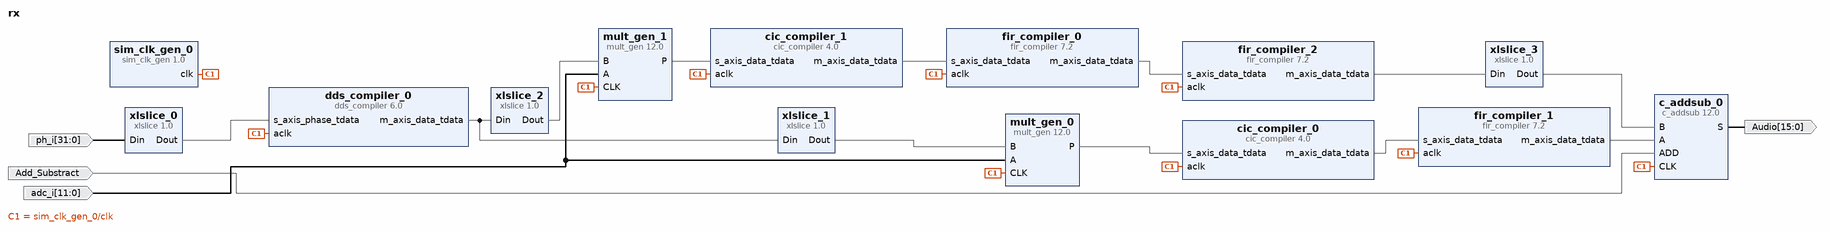
[diagram p0: block diagram of the top level]
# Vivado block design rx, xc7z020clg484-1, Vivado 2024.1
create_bd_design rx

create_bd_port -dir I -from 11 -to 0 -type data adc_i
create_bd_port -dir I -type data Add_Substract
create_bd_port -dir O -from 15 -to 0 -type data Audio
create_bd_port -dir I -from 31 -to 0 -type data ph_i

create_bd_cell -type ip -vlnv xilinx.com:ip:mult_gen:12.0 mult_gen_0
set_property -dict [list \
  CONFIG.Multiplier_Construction Use_LUTs \
  CONFIG.OutputWidthHigh 31 \
  CONFIG.PortAWidth 12 \
  CONFIG.PortBWidth 20 \
  CONFIG.SyncClear false \
  CONFIG.Use_Custom_Output_Width true \
] [get_bd_cells mult_gen_0]
create_bd_cell -type ip -vlnv xilinx.com:ip:mult_gen:12.0 mult_gen_1
set_property -dict [list \
  CONFIG.Multiplier_Construction Use_LUTs \
  CONFIG.OutputWidthHigh 31 \
  CONFIG.PortAWidth 12 \
  CONFIG.PortBWidth 20 \
  CONFIG.SyncClear false \
  CONFIG.Use_Custom_Output_Width true \
] [get_bd_cells mult_gen_1]
create_bd_cell -type ip -vlnv xilinx.com:ip:dds_compiler:6.0 dds_compiler_0
set_property -dict [list \
  CONFIG.DATA_Has_TLAST Not_Required \
  CONFIG.DDS_Clock_Rate 100 \
  CONFIG.Frequency_Resolution 0.4 \
  CONFIG.Has_Phase_Out false \
  CONFIG.Latency 7 \
  CONFIG.M_DATA_Has_TUSER Not_Required \
  CONFIG.Noise_Shaping Taylor_Series_Corrected \
  CONFIG.OUTPUT_FORM Twos_Complement \
  CONFIG.Output_Frequency1 0 \
  CONFIG.Output_Selection Sine_and_Cosine \
  CONFIG.Output_Type Integer \
  CONFIG.Output_Width 20 \
  CONFIG.PINC1 0 \
  CONFIG.Parameter_Entry Hardware_Parameters \
  CONFIG.PartsPresent SIN_COS_LUT_only \
  CONFIG.Phase_Width 25 \
  CONFIG.S_PHASE_Has_TUSER Not_Required \
] [get_bd_cells dds_compiler_0]
create_bd_cell -type ip -vlnv xilinx.com:ip:xlslice:1.0 xlslice_1
set_property -dict {CONFIG.DIN_FROM 43 CONFIG.DIN_TO 24 CONFIG.DIN_WIDTH 48 CONFIG.DOUT_WIDTH 20} [get_bd_cells xlslice_1]
create_bd_cell -type ip -vlnv xilinx.com:ip:xlslice:1.0 xlslice_2
set_property -dict {CONFIG.DIN_FROM 19 CONFIG.DIN_TO 0 CONFIG.DIN_WIDTH 48 CONFIG.DOUT_WIDTH 20} [get_bd_cells xlslice_2]
create_bd_cell -type ip -vlnv xilinx.com:ip:cic_compiler:4.0 cic_compiler_0
set_property -dict [list \
  CONFIG.Clock_Frequency 65 \
  CONFIG.Filter_Type Decimation \
  CONFIG.Fixed_Or_Initial_Rate 43 \
  CONFIG.Input_Data_Width 32 \
  CONFIG.Input_Sample_Frequency 65 \
  CONFIG.Maximum_Rate 43 \
  CONFIG.Minimum_Rate 43 \
  CONFIG.Output_Data_Width 32 \
  CONFIG.Quantization Truncation \
  CONFIG.RateSpecification Frequency_Specification \
  CONFIG.SamplePeriod 1 \
] [get_bd_cells cic_compiler_0]
create_bd_cell -type ip -vlnv xilinx.com:ip:cic_compiler:4.0 cic_compiler_1
set_property -dict [list \
  CONFIG.Clock_Frequency 65 \
  CONFIG.Filter_Type Decimation \
  CONFIG.Fixed_Or_Initial_Rate 43 \
  CONFIG.Input_Data_Width 32 \
  CONFIG.Input_Sample_Frequency 65 \
  CONFIG.Maximum_Rate 43 \
  CONFIG.Minimum_Rate 43 \
  CONFIG.Output_Data_Width 32 \
  CONFIG.Quantization Truncation \
  CONFIG.RateSpecification Frequency_Specification \
  CONFIG.SamplePeriod 1 \
] [get_bd_cells cic_compiler_1]
create_bd_cell -type ip -vlnv xilinx.com:ip:fir_compiler:7.2 fir_compiler_0
set_property -dict [list \
  CONFIG.Clock_Frequency 64.896 \
  CONFIG.CoefficientSource COE_File \
  CONFIG.CoefficientVector -202,-158,-58,246,917,2079,3771,5916,8318,10689,12701,14052,14527,14052,12701,10689,8318,5916,3771,2079,917,246,-58,-158,-202 \
  CONFIG.Coefficient_File ../../../../../../../../matlab/fir_decimator.coe \
  CONFIG.Coefficient_Fractional_Bits 0 \
  CONFIG.Coefficient_Sets 1 \
  CONFIG.Coefficient_Sign Signed \
  CONFIG.Coefficient_Structure Inferred \
  CONFIG.Coefficient_Width 16 \
  CONFIG.Data_Width 32 \
  CONFIG.Decimation_Rate 8 \
  CONFIG.Filter_Architecture Systolic_Multiply_Accumulate \
  CONFIG.Filter_Type Decimation \
  CONFIG.Interpolation_Rate 1 \
  CONFIG.Number_Channels 1 \
  CONFIG.Output_Rounding_Mode Non_Symmetric_Rounding_Up \
  CONFIG.Output_Width 16 \
  CONFIG.Quantization Integer_Coefficients \
  CONFIG.RateSpecification Frequency_Specification \
  CONFIG.Sample_Frequency 0.384 \
  CONFIG.Zero_Pack_Factor 1 \
] [get_bd_cells fir_compiler_0]
create_bd_cell -type ip -vlnv xilinx.com:ip:fir_compiler:7.2 fir_compiler_1
set_property -dict [list \
  CONFIG.Clock_Frequency 64.896 \
  CONFIG.CoefficientSource COE_File \
  CONFIG.CoefficientVector -202,-158,-58,246,917,2079,3771,5916,8318,10689,12701,14052,14527,14052,12701,10689,8318,5916,3771,2079,917,246,-58,-158,-202 \
  CONFIG.Coefficient_File ../../../../../../../../matlab/fir_decimator.coe \
  CONFIG.Coefficient_Fractional_Bits 0 \
  CONFIG.Coefficient_Sets 1 \
  CONFIG.Coefficient_Sign Signed \
  CONFIG.Coefficient_Structure Inferred \
  CONFIG.Coefficient_Width 16 \
  CONFIG.Data_Width 32 \
  CONFIG.Decimation_Rate 8 \
  CONFIG.Filter_Architecture Systolic_Multiply_Accumulate \
  CONFIG.Filter_Type Decimation \
  CONFIG.Interpolation_Rate 1 \
  CONFIG.Number_Channels 1 \
  CONFIG.Output_Rounding_Mode Non_Symmetric_Rounding_Up \
  CONFIG.Output_Width 16 \
  CONFIG.Quantization Integer_Coefficients \
  CONFIG.RateSpecification Frequency_Specification \
  CONFIG.Sample_Frequency 0.384 \
  CONFIG.Zero_Pack_Factor 1 \
] [get_bd_cells fir_compiler_1]
create_bd_cell -type ip -vlnv xilinx.com:ip:sim_clk_gen:1.0 sim_clk_gen_0
set_property -dict {CONFIG.FREQ_HZ 64896000} [get_bd_cells sim_clk_gen_0]
create_bd_cell -type ip -vlnv xilinx.com:ip:fir_compiler:7.2 fir_compiler_2
set_property -dict [list \
  CONFIG.Clock_Frequency 64.896 \
  CONFIG.CoefficientSource COE_File \
  CONFIG.Coefficient_File ../../../../../../../../matlab/fir_hilbert.coe \
  CONFIG.Coefficient_Fractional_Bits 15 \
  CONFIG.Coefficient_Sets 1 \
  CONFIG.Coefficient_Sign Signed \
  CONFIG.Coefficient_Structure Hilbert \
  CONFIG.Coefficient_Width 16 \
  CONFIG.Decimation_Rate 1 \
  CONFIG.Filter_Architecture Systolic_Multiply_Accumulate \
  CONFIG.Filter_Type Hilbert \
  CONFIG.Interpolation_Rate 1 \
  CONFIG.Number_Channels 1 \
  CONFIG.Output_Rounding_Mode Non_Symmetric_Rounding_Up \
  CONFIG.Output_Width 16 \
  CONFIG.Quantization Quantize_Only \
  CONFIG.RateSpecification Frequency_Specification \
  CONFIG.Sample_Frequency 0.048 \
  CONFIG.Zero_Pack_Factor 1 \
] [get_bd_cells fir_compiler_2]
create_bd_cell -type ip -vlnv xilinx.com:ip:c_addsub:12.0 c_addsub_0
set_property -dict [list \
  CONFIG.A_Width 16 \
  CONFIG.Add_Mode Add_Subtract \
  CONFIG.B_Value 0000000000000000 \
  CONFIG.B_Width 16 \
  CONFIG.Latency 1 \
  CONFIG.Out_Width 16 \
] [get_bd_cells c_addsub_0]
create_bd_cell -type ip -vlnv xilinx.com:ip:xlslice:1.0 xlslice_3
set_property -dict {CONFIG.DIN_FROM 31 CONFIG.DIN_TO 16 CONFIG.DIN_WIDTH 32 CONFIG.DOUT_WIDTH 16} [get_bd_cells xlslice_3]
create_bd_cell -type ip -vlnv xilinx.com:ip:xlslice:1.0 xlslice_0
set_property -dict {CONFIG.DIN_FROM 31 CONFIG.DOUT_WIDTH 32} [get_bd_cells xlslice_0]

# ---- connections ----

connect_bd_net [get_bd_ports Add_Substract] [get_bd_pins c_addsub_0/ADD]
connect_bd_net [get_bd_pins sim_clk_gen_0/clk] \
  [get_bd_pins mult_gen_0/CLK] [get_bd_pins dds_compiler_0/aclk] [get_bd_pins mult_gen_1/CLK] \
  [get_bd_pins cic_compiler_1/aclk] [get_bd_pins cic_compiler_0/aclk] [get_bd_pins fir_compiler_0/aclk] \
  [get_bd_pins fir_compiler_1/aclk] [get_bd_pins fir_compiler_2/aclk] [get_bd_pins c_addsub_0/CLK]
connect_bd_net [get_bd_ports adc_i] [get_bd_pins mult_gen_0/A] [get_bd_pins mult_gen_1/A]
connect_bd_net [get_bd_pins c_addsub_0/S] [get_bd_ports Audio]
connect_bd_net [get_bd_pins cic_compiler_0/m_axis_data_tdata] [get_bd_pins fir_compiler_1/s_axis_data_tdata]
connect_bd_net [get_bd_pins cic_compiler_1/m_axis_data_tdata] [get_bd_pins fir_compiler_0/s_axis_data_tdata]
connect_bd_net [get_bd_pins dds_compiler_0/m_axis_data_tdata] [get_bd_pins xlslice_1/Din] [get_bd_pins xlslice_2/Din]
connect_bd_net [get_bd_pins fir_compiler_0/m_axis_data_tdata] [get_bd_pins fir_compiler_2/s_axis_data_tdata]
connect_bd_net [get_bd_pins fir_compiler_1/m_axis_data_tdata] [get_bd_pins c_addsub_0/A]
connect_bd_net [get_bd_pins fir_compiler_2/m_axis_data_tdata] [get_bd_pins xlslice_3/Din]
connect_bd_net [get_bd_pins mult_gen_0/P] [get_bd_pins cic_compiler_0/s_axis_data_tdata]
connect_bd_net [get_bd_pins mult_gen_1/P] [get_bd_pins cic_compiler_1/s_axis_data_tdata]
connect_bd_net [get_bd_ports ph_i] [get_bd_pins xlslice_0/Din]
connect_bd_net [get_bd_pins xlslice_0/Dout] [get_bd_pins dds_compiler_0/s_axis_phase_tdata]
connect_bd_net [get_bd_pins xlslice_1/Dout] [get_bd_pins mult_gen_0/B]
connect_bd_net [get_bd_pins xlslice_2/Dout] [get_bd_pins mult_gen_1/B]
connect_bd_net [get_bd_pins xlslice_3/Dout] [get_bd_pins c_addsub_0/B]

validate_bd_design
save_bd_design
